# EAGLE design Comparator Breakout MCP6561 (EAGLE 9.1.0)
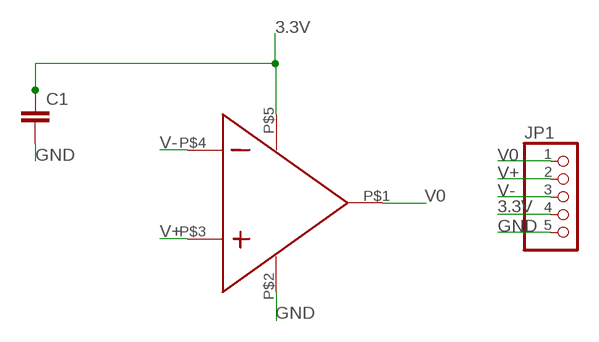
[diagram p0: schematic, sheet 1]

## Parts
C1  C-EUC0805  [C0805]
JP1  PINHD-1X5  [1X05]
U$1  MCP6561  [SC70-5]

## Nets
3.3V: C1.1 JP1.4 U$1.P$5(VDD)
GND: C1.2 JP1.5 U$1.P$2(VSS)
V0: JP1.1 U$1.P$1(OUT)
V+: JP1.2 U$1.P$3(IN+)
V-: JP1.3 U$1.P$4(IN-)

## Library data of the parts
C1 = resistor:C-EU: CAPACITOR, European symbol
JP1 = pinhead:PINHD-1X5: PIN HEADER
U$1 = Personal:MCP6561

## Board
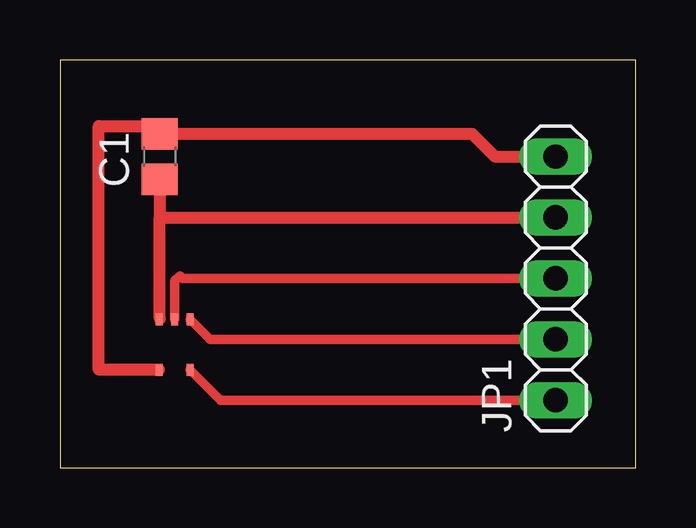
[diagram p1: board, top side]

Size 24 x 17 mm. Coordinates in mm from the lower left corner, seen from the top.
Outline: 0,0 24,0 24,17 0,17 0,0
Copper layers (1*16): Top 0.035mm / dielectric 1.5mm / Bottom 0.035mm
Design rules "default": minimum track width 6mil, minimum drill 0.35mm, track to track 6mil, track to pad 6mil, pad to pad 6mil, via to via 6mil, smd to smd 6mil, copper to edge 40mil, drill to drill 6mil, minimum pad ring 10mil, minimum via ring 8mil, stop-mask expansion 4mil, vias tented up to drill 0mil, thermal gap 10mil

### Footprints (pad centres in the part's own frame; a part is rotated, then mirrored left to right if it is on the bottom)
C0805 = smd 1.3 x 1.5: 1 -0.95,0; 2 0.95,0
1X05 = drill 1.016 long: 1 -5.08,0; 2 -2.54,0; 3 0,0; 4 2.54,0; 5 5.08,0
SC70-5 = smd 0.3 x 0.5: P$1 0,0; P$2 1.3,0; P$3 0,-2.1; P$4 0.65,-2.1; P$5 1.3,-2.1

### Placement (x,y rotation side)
C1  4.16,12.97 90 top
JP1  20.67,7.89 90 top
U$1  5.43,4.08 180 top

### Tracks (layer width: path | path; a pad name or v marks a point on that pad's centre or on a via)
3.3V  (1 unrouted)
  Top 0.5: 4.16,6.21 4.16,10.43 | 4.16,10.43 JP1.4 | C1.1 4.16,10.43
GND
  Top 0.152: 3.84,14.24 C1.2
  Top 0.5: U$1.P$2 1.62,4.08 1.62,14.24 3.84,14.24 | C1.2 14,13.92 17.18,13.92 18.13,12.97 JP1.5
V0
  Top 0.4: U$1.P$1 6.7,2.81 JP1.1
V+
  Top 0.4: U$1.P$3 6.26,5.35 JP1.2
V-
  Top 0.4: U$1.P$4 4.78,7.78 5,8 5.11,7.89 JP1.3